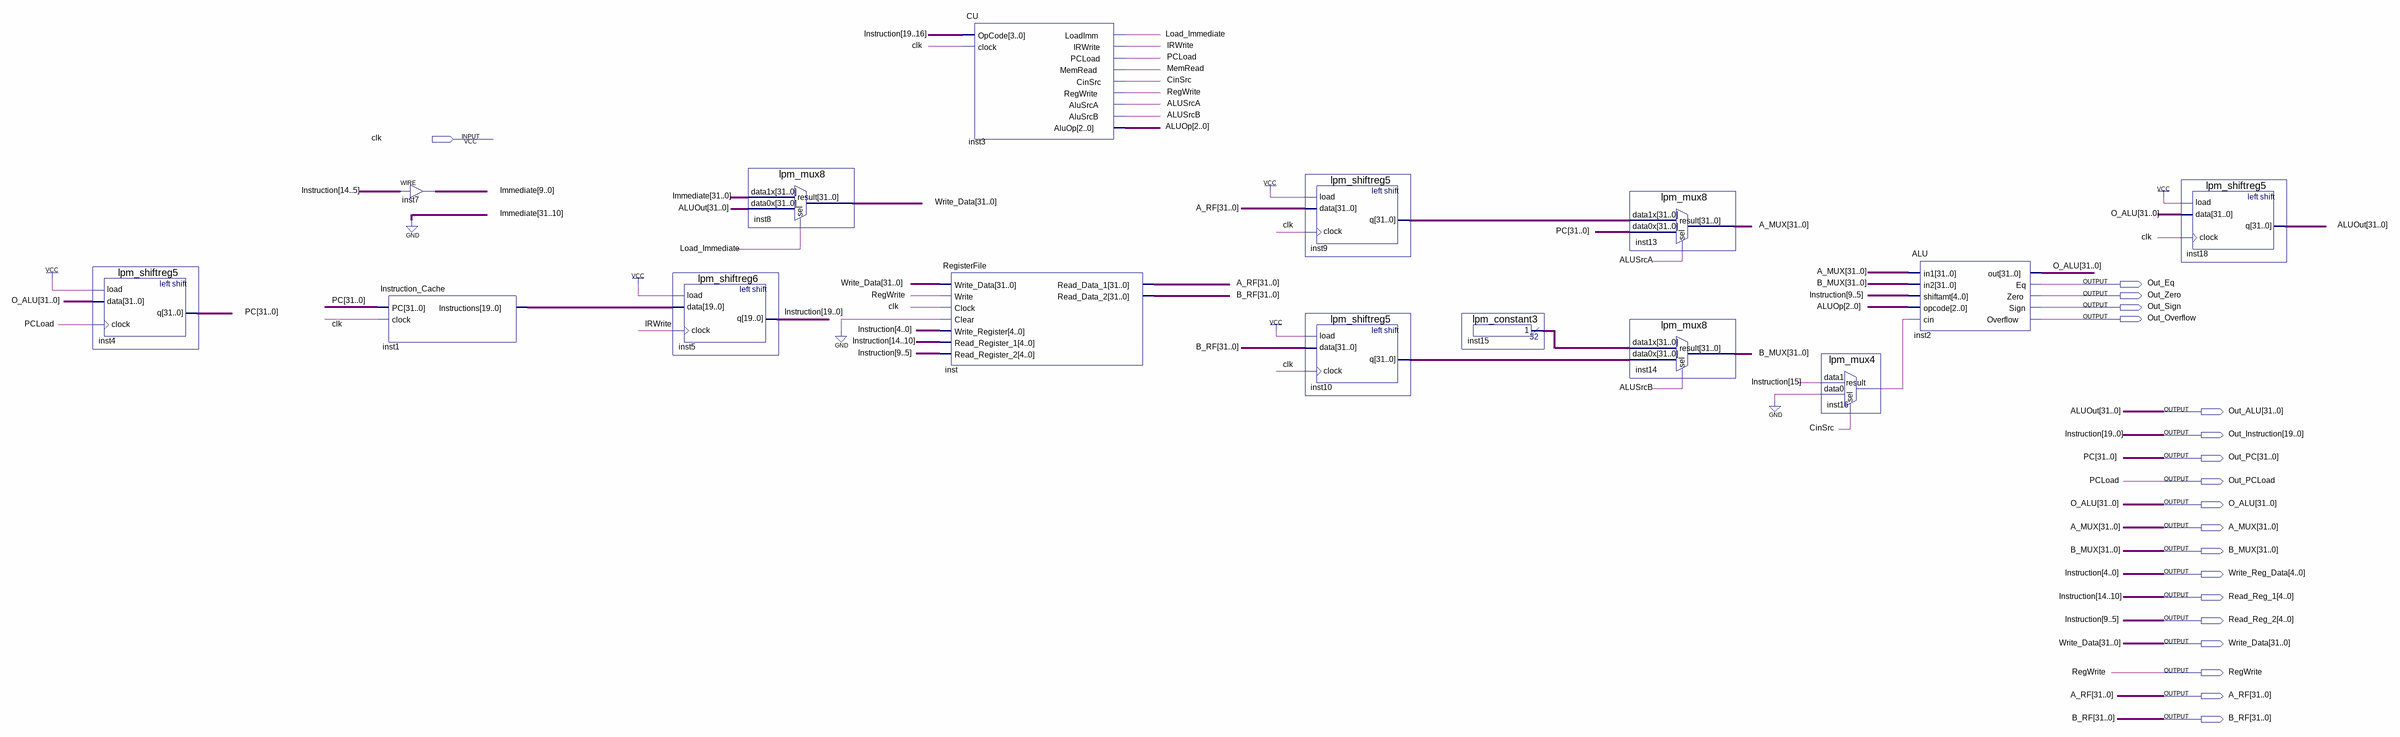
[diagram p0: schematic sheet]
// Quartus schematic Final_CPU.bdf as structural Verilog: 15 symbols, 19 pins
module Final_CPU (
  input  clk,
  output Out_Eq,
  output Out_Zero,
  output Out_Sign,
  output Out_Overflow,
  output [31:0] Out_ALU,
  output [19:0] Out_Instruction,
  output [31:0] Out_PC,
  output Out_PCLoad,
  output [31:0] O_ALU,
  output [31:0] A_MUX,
  output [31:0] B_MUX,
  output [4:0] Write_Reg_Data,
  output [4:0] Read_Reg_1,
  output [4:0] Read_Reg_2,
  output [31:0] Write_Data,
  output RegWrite,
  output [31:0] A_RF,
  output [31:0] B_RF
);

  wire ALUSrcA, ALUSrcB, CinSrc, inst16_result, IRWrite, Load_Immediate, MemRead;
  wire [2:0] ALUOp;
  wire [9:0] Immediate;
  wire [19:0] inst1_instructions;
  wire [31:0] inst9_q, inst10_q, inst15_result;

  lpm_shiftreg5 inst4 (.load(1'b1), .data(O_ALU), .clock(Out_PCLoad), .q(Out_PC));
  assign Immediate = Out_Instruction[14:5];  // WIRE inst7
  Instruction_Cache inst1 (.PC(Out_PC), .clock(clk), .Instructions(inst1_instructions));
  lpm_shiftreg6 inst5 (.load(1'b1), .data(inst1_instructions), .clock(IRWrite), .q(Out_Instruction));
  lpm_mux8 inst8 (.data1x({{22{1'b0}}, Immediate}), .data0x(Out_ALU), .sel(Load_Immediate), .result(Write_Data));
  CU inst3 (
    .OpCode(Out_Instruction[19:16]), .clock(clk), .LoadImm(Load_Immediate), .IRWrite(IRWrite),
    .PCLoad(Out_PCLoad), .MemRead(MemRead), .CinSrc(CinSrc), .RegWrite(RegWrite), .AluSrcA(ALUSrcA),
    .AluSrcB(ALUSrcB), .AluOp(ALUOp));
  RegisterFile inst (
    .Write_Data(Write_Data), .Write(RegWrite), .Clock(clk), .Clear(1'b0),
    .Write_Register(Out_Instruction[4:0]), .Read_Register_1(Out_Instruction[14:10]),
    .Read_Register_2(Out_Instruction[9:5]), .Read_Data_1(A_RF), .Read_Data_2(B_RF));
  lpm_shiftreg5 inst9 (.load(1'b1), .data(A_RF), .clock(clk), .q(inst9_q));
  lpm_shiftreg5 inst10 (.load(1'b1), .data(B_RF), .clock(clk), .q(inst10_q));
  lpm_constant3 inst15 (.result(inst15_result));
  lpm_mux8 inst13 (.data1x(inst9_q), .data0x(Out_PC), .sel(ALUSrcA), .result(A_MUX));
  lpm_mux8 inst14 (.data1x(inst15_result), .data0x(inst10_q), .sel(ALUSrcB), .result(B_MUX));
  lpm_mux4 inst16 (.data1(Out_Instruction[15]), .data0(1'b0), .sel(CinSrc), .result(inst16_result));
  ALU inst2 (
    .in1(A_MUX), .in2(B_MUX), .shiftamt(Out_Instruction[9:5]), .opcode(ALUOp), .cin(inst16_result),
    .out(O_ALU), .Eq(Out_Eq), .Zero(Out_Zero), .Sign(Out_Sign), .Overflow(Out_Overflow));
  lpm_shiftreg5 inst18 (.load(1'b1), .data(O_ALU), .clock(clk), .q(Out_ALU));

  assign Read_Reg_1 = Out_Instruction[14:10];
  assign Read_Reg_2 = Out_Instruction[9:5];
  assign Write_Reg_Data = Out_Instruction[4:0];

  // Other names for the same wires on the sheet: ALUOut[31:0] = Out_ALU; Instruction[19:0] = Out_Instruction;
  //   PC[31:0] = Out_PC; PCLoad = Out_PCLoad
endmodule
